# Altium schematic sheet TLE5012.SchDoc
size A4
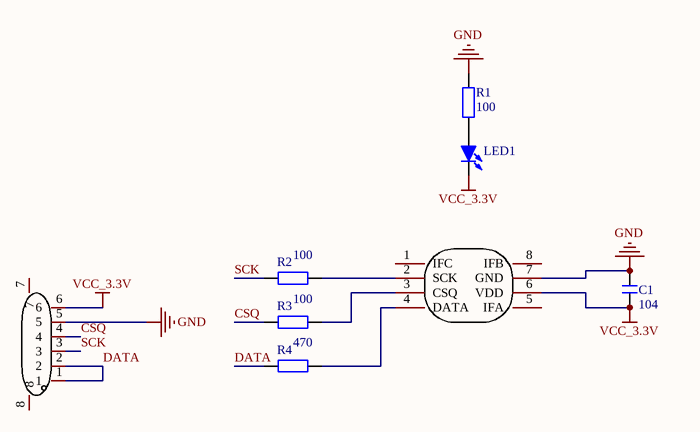
[diagram p0: TLE5012.SchDoc]

## Parts
C1  104  [C0402_L]
CN1  WAFER-SH1.0-6PWB  [SH1.0-6P]  (value not drawn)
LED1  (no value)  [LED0603_G]
R1  100  [R0603_L]
R2  100  [R0805_L]
R3  100  [R0805_L]
R4  470  [R0805_L]
U1  TLE5012BE1000  [PG-DSO-8_L5.0-W4.0-P1.27-LS6.0-BL]  (value not drawn)

## Nets
GND: C1.2 CN1.5 R1.2 U1.7(GND)
VCC_3.3V: C1.1 CN1.6 LED1.2(K) U1.6(VDD)
CSQ: CN1.4 R3.1
DATA: CN1.1 CN1.2 R4.1
SCK: CN1.3 R2.1
NetLED1_1: LED1.1(A) R1.1
NetR2_2: R2.2 U1.2(SCK)
NetR3_2: R3.2 U1.3(CSQ)
NetR4_2: R4.2 U1.4(DATA)

Not connected (* = marked no-connect by the designer): CN1 7 8; U1 1(IFC) 5(IFA) 8(IFB)

## Library data of the parts
C1 = C: 贴片电容; BOM名称: 无极性贴片电容; 淘宝ID: 封装库来自淘宝 ID：黄晶宝石; 联系售后，技术支持: https://shop463601444.taobao.com; 唯一出售店铺网址: https://shop463601444.taobao.com
CN1 = WAFER-SH1.0-6PWB: Manufacturer: XUNPU(Ѷ��); Add into BOM: yes; Pins Structure: 1x6P; Pitch: 1mm; Number of PINs Per Row: 6; Current Rating (Max): 1A; Symbol: WAFER-SH1.0-6PWB; Device: WAFER-SH1.0-6PWB; Supplier: LCSC; Supplier Part: C3029345; Manufacturer Part: WAFER-SH1.0-6PWB; JLCPCB Part Class: Extended Part; LCSC Part Name: 1x6P ���:1mm ����; Supplier Footprint: SMD,P=1mm,����; Datasheet: https://atta.szlcsc.com/upload/public/pdf/source/20220527/1879B8210BD3B2006BCEAC1A40D397B6.pdf; Convert to PCB: yes; Mounting Style: ����; Number of Pins: 6P; Number of Rows: 1; Operating Temperature Range: -25��~+85��
LED1 = LED-SMD: 贴片LED; 版权归属: 封装库来自淘宝 ID：黄晶宝石; BOM名称: 贴片LED; 学习资源: https://item.taobao.com/item.htm?id=566775463719
R1-R4 = R: 贴片电阻; 版权归属: 来自淘宝 ID：黄晶宝石; 封装库来自淘宝卖家 ID：黄晶宝石: 其他店铺购入均为盗版，不享受售后技术支持服务，请立即申请退款; BOM名称: 贴片电阻; 联系售后: https://item.taobao.com/item.htm?id=566775463719
U1 = TLE5012BE1000: Manufacturer: Infineon(Ӣ����); Symbol: TLE5012BE1000XUMA1; Add into BOM: yes; Rotation Angle: 0��~360��; Device: TLE5012BE1000; Supplier: LCSC; Manufacturer Part: TLE5012BE1000; Supplier Part: C123083; JLCPCB Part Class: Extended Part; LCSC Part Name: TLE5012BE1000; Supplier Footprint: SO-8; Datasheet: https://atta.szlcsc.com/upload/public/pdf/source/20170728/C123083_1501225763065848823.pdf; Convert to PCB: yes